# Altium schematic sheet AD835_Mixer.SchDoc
size A4; SheetNumber: 4; SheetTotal: 7
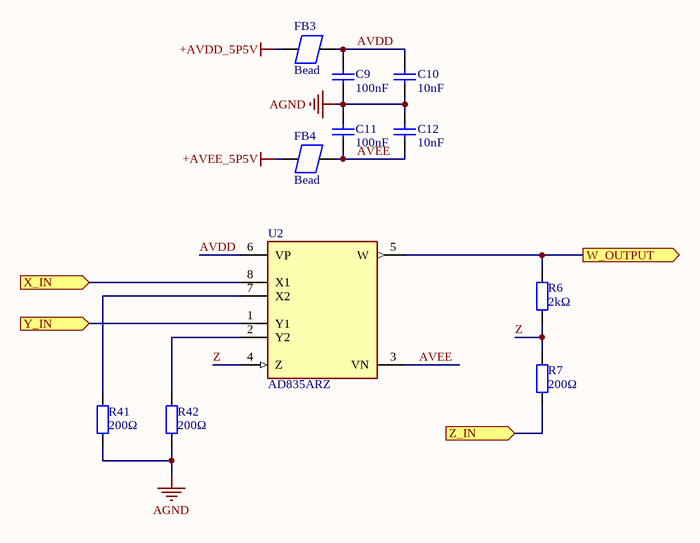
[diagram p0: AD835_Mixer.SchDoc]

## Parts
C9  100nF  [0603_C]
C10  10nF  [0603_C]
C11  100nF  [0603_C]
C12  10nF  [0603_C]
FB3  Bead  [0805_L]
FB4  Bead  [0805_L]
R6  2kΩ  [0603_R]
R7  200Ω  [0603_R]
R41  200Ω  [0603_R]
R42  200Ω  [0603_R]
U2  AD835ARZ  [FP-R-8-IPC_A]

## Ports
W_OUTPUT (out), X_IN (in), Y_IN (in), Z_IN (in)

## Nets
+AVDD_5P5V: FB3.1
+AVEE_5P5V: FB4.1
AGND: C9.1 C10.1 C11.1 C12.1 R41.1 R42.1
AVDD: C9.2 C10.2 FB3.2 U2.6(VP)
AVEE: C11.2 C12.2 FB4.2 U2.3(VN)
W_OUTPUT: R6.2 U2.5(W) ; port W_OUTPUT
X_IN: U2.8(X1) ; port X_IN
Y_IN: U2.1(Y1) ; port Y_IN
Z: R6.1 R7.2 U2.4(Z)
Z_IN: R7.1 ; port Z_IN
NetR41_2: R41.2 U2.7(X2)
NetR42_2: R42.2 U2.2(Y2)

## Library data of the parts
C9 C11 = 0603 100nF (104) 10% 50V: 贴片电容; ComponentLink1Description: 供应商链接; ComponentLink1URL: http://www.szlcsc.com/product/details_15331.html; Package: 0603; Supplier: LC; SuppliersPartNumber: C14663
C10 C12 = 0603 10nF (103) 10% 50V: 贴片电容; ComponentLink1Description: 供应商链接; ComponentLink1URL: http://www.szlcsc.com/product/details_58143.html; Package: 0603; Supplier: LC; SuppliersPartNumber: C57112
R6 = 0603 2KΩ (2001) 1%: 贴片电阻; ComponentLink1Description: 供应商链接; ComponentLink1URL: http://www.szlcsc.com/product/details_23702.html; Package: 0603; Supplier: LC; SuppliersPartNumber: C22975
R7 R41 R42 = 0603 200Ω (2000) 1%: 贴片电阻; ComponentLink1Description: 供应商链接; ComponentLink1URL: http://www.szlcsc.com/product/details_8708.html; Package: 0603; Supplier: LC; SuppliersPartNumber: C8218
U2 = CMP-09114-000033-1: ANALOG MULTIPLIER OR DIVIDER, 25; Min Dual Supply Voltage: 4.5V; Number of Amplifiers: 3; Nominal Supply Current: 16mA; Max Dual Supply Voltage: 5.5V; Max Power Dissipation: 300mW; Number of Circuits: 1; Operating Supply Current: 25mA; Number of Channels: 2; Max Input Voltage: 1V; -3db Bandwidth: 250MHz; Dual Supply Voltage: 5V; Slew Rate: 1000V/µs; Accuracy: 2%; Number of Bits: 4; Settling Time: 20ns; Output Voltage: 2.5V; Contact Plating: Tin; Height: 1.5mm; Number of Elements: 1; Min Supply Voltage: 4.5V; Mount: Surface Mount; Operating Supply Voltage: 5V; Package Quantity: 1; Max Frequency: 250MHz; Lead Free: Contains Lead; Length: 5mm; Min Operating Temperature: -40°C; Supply Current: 16mA; Max Operating Temperature: 85°C; Width: 4mm; Max Supply Voltage: 5.5V; RoHS Compliant: Yes; Radiation Hardening: No; REACH SVHC: No SVHC; Series: -; Number of Pins: 8; Case/Package: SOIC; Packaging: Rail/Tube